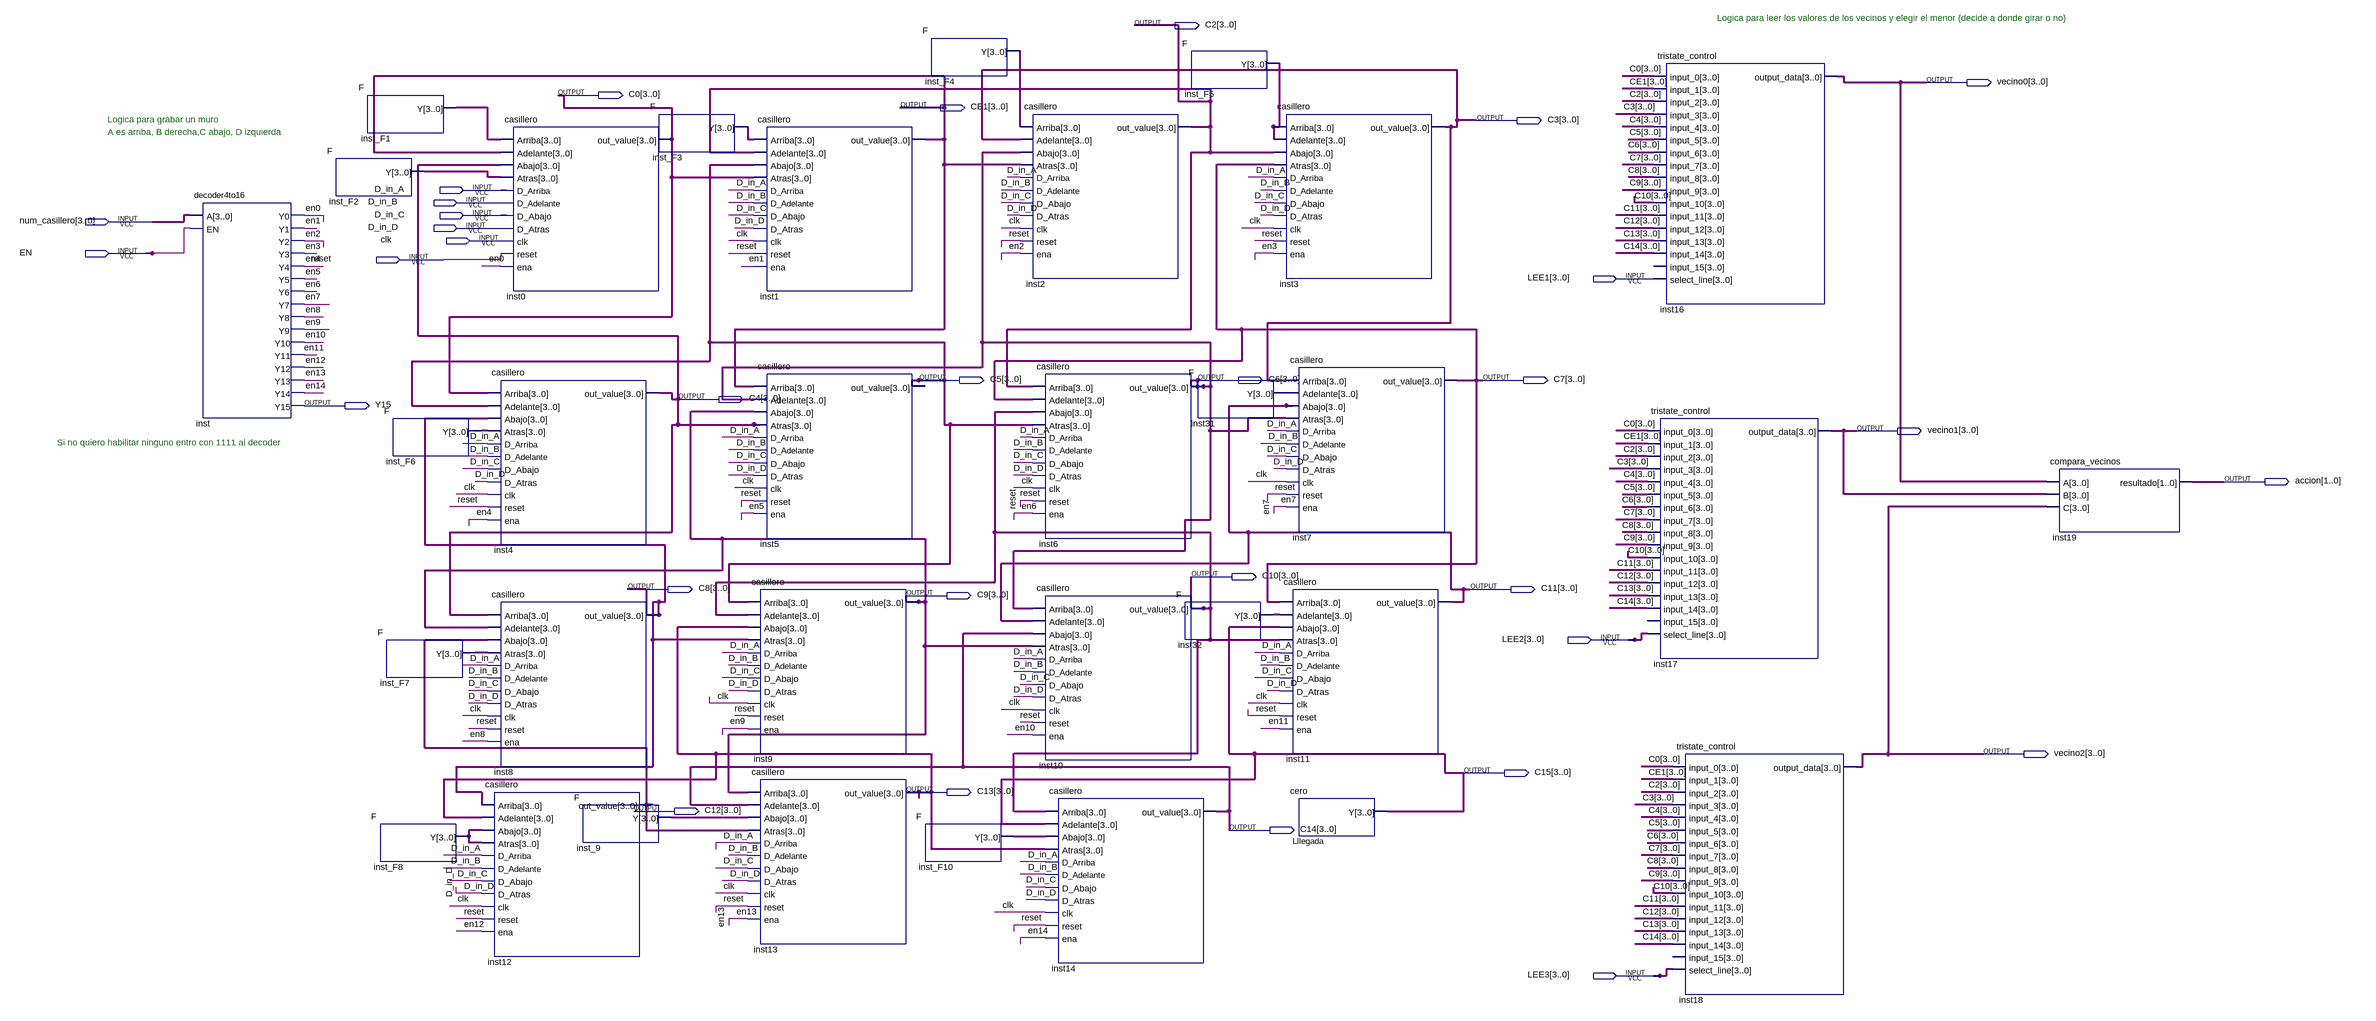
[diagram p0: schematic sheet]
// Quartus schematic matriz_pru.bdf as structural Verilog: 33 symbols, 32 pins
module matriz_pru (
  input  D_in_A,
  input  D_in_B,
  input  D_in_C,
  input  [3:0] num_casillero,
  input  D_in_D,
  input  clk,
  input  EN,
  input  reset,
  input  [3:0] LEE1,
  input  [3:0] LEE2,
  input  [3:0] LEE3,
  output [3:0] C2,
  output [3:0] vecino0,
  output [3:0] C0,
  output [3:0] CE1,
  output [3:0] C3,
  output [3:0] C5,
  output [3:0] C6,
  output [3:0] C7,
  output [3:0] C4,
  output Y15,
  output [3:0] vecino1,
  output [1:0] accion,
  output [3:0] C10,
  output [3:0] C8,
  output [3:0] C11,
  output [3:0] C9,
  output [3:0] vecino2,
  output [3:0] C15,
  output [3:0] C13,
  output [3:0] C12,
  output [3:0] C14
);

  wire en0, en1, en2, en3, en4, en5, en6, en7, en8, en9, en10, en11, en12, en13, en14;
  wire [3:0] inst12_out_value, inst31_y, inst32_y, inst_9_y, inst_F1_y, inst_F2_y, inst_F3_y, inst_F4_y,
       inst_F5_y, inst_F6_y, inst_F7_y, inst_F8_y, inst_F10_y;

  decoder4to16 inst (
    .A(num_casillero), .EN(EN), .Y0(en0), .Y1(en1), .Y2(en2), .Y3(en3), .Y4(en4), .Y5(en5), .Y6(en6),
    .Y7(en7), .Y8(en8), .Y9(en9), .Y10(en10), .Y11(en11), .Y12(en12), .Y13(en13), .Y14(en14), .Y15(Y15));
  F inst_F2 (.Y(inst_F2_y));
  F inst_F1 (.Y(inst_F1_y));
  F inst_F6 (.Y(inst_F6_y));
  F inst_F7 (.Y(inst_F7_y));
  F inst_F8 (.Y(inst_F8_y));
  casillero inst12 (
    .Arriba(C8), .Adelante(C13), .Abajo(inst_F8_y), .Atras(inst_F8_y), .D_Arriba(D_in_A),
    .D_Adelante(D_in_B), .D_Abajo(D_in_C), .D_Atras(D_in_D), .clk(clk), .reset(reset), .ena(en12),
    .out_value(inst12_out_value));
  casillero inst0 (
    .Arriba(inst_F1_y), .Adelante(CE1), .Abajo(C4), .Atras(inst_F2_y), .D_Arriba(D_in_A),
    .D_Adelante(D_in_B), .D_Abajo(D_in_C), .D_Atras(D_in_D), .reset(reset), .ena(en0), .out_value(C0));  // open: clk
  casillero inst4 (
    .Arriba(C0), .Adelante(C5), .Abajo(C8), .Atras(inst_F6_y), .D_Arriba(D_in_A), .D_Adelante(D_in_B),
    .D_Abajo(D_in_C), .D_Atras(D_in_D), .clk(clk), .reset(reset), .ena(en4), .out_value(C4));
  casillero inst8 (
    .Arriba(C4), .Adelante(C9), .Abajo(inst12_out_value), .Atras(inst_F7_y), .D_Arriba(D_in_A),
    .D_Adelante(D_in_B), .D_Abajo(D_in_C), .D_Atras(D_in_D), .clk(clk), .reset(reset), .ena(en8),
    .out_value(C8));
  F inst_9 (.Y(inst_9_y));
  F inst_F3 (.Y(inst_F3_y));
  casillero inst1 (
    .Arriba(inst_F3_y), .Adelante(C2), .Abajo(C5), .Atras(C0), .D_Arriba(D_in_A), .D_Adelante(D_in_B),
    .D_Abajo(D_in_C), .D_Atras(D_in_D), .clk(clk), .reset(reset), .ena(en1), .out_value(CE1));
  casillero inst5 (
    .Arriba(CE1), .Adelante(C6), .Abajo(C9), .Atras(C4), .D_Arriba(D_in_A), .D_Adelante(D_in_B),
    .D_Abajo(D_in_C), .D_Atras(D_in_D), .clk(clk), .reset(reset), .ena(en5), .out_value(C5));
  casillero inst9 (
    .Arriba(C5), .Adelante(C10), .Abajo(C13), .Atras(C8), .D_Arriba(D_in_A), .D_Adelante(D_in_B),
    .D_Abajo(D_in_C), .D_Atras(D_in_D), .clk(clk), .reset(reset), .ena(en9), .out_value(C9));
  casillero inst13 (
    .Arriba(C9), .Adelante(C14), .Abajo(inst_9_y), .Atras(inst12_out_value), .D_Arriba(D_in_A),
    .D_Adelante(D_in_B), .D_Abajo(D_in_C), .D_Atras(D_in_D), .clk(clk), .reset(reset), .ena(en13),
    .out_value(C13));
  F inst_F4 (.Y(inst_F4_y));
  F inst_F10 (.Y(inst_F10_y));
  casillero inst2 (
    .Arriba(inst_F4_y), .Adelante(C3), .Abajo(C6), .Atras(CE1), .D_Arriba(D_in_A), .D_Adelante(D_in_B),
    .D_Abajo(D_in_C), .D_Atras(D_in_D), .clk(clk), .reset(reset), .ena(en2), .out_value(C2));
  casillero inst6 (
    .Arriba(C2), .Adelante(C7), .Abajo(C10), .Atras(C5), .D_Arriba(D_in_A), .D_Adelante(D_in_B),
    .D_Abajo(D_in_C), .D_Atras(D_in_D), .clk(clk), .reset(reset), .ena(en6), .out_value(C6));
  casillero inst10 (
    .Arriba(C6), .Adelante(C11), .Abajo(C14), .Atras(C9), .D_Arriba(D_in_A), .D_Adelante(D_in_B),
    .D_Abajo(D_in_C), .D_Atras(D_in_D), .clk(clk), .reset(reset), .ena(en10), .out_value(C10));
  casillero inst14 (
    .Arriba(C10), .Adelante(C15), .Abajo(inst_F10_y), .Atras(C13), .D_Arriba(D_in_A), .D_Adelante(D_in_B),
    .D_Abajo(D_in_C), .D_Atras(D_in_D), .clk(clk), .reset(reset), .ena(en14), .out_value(C14));
  F inst_F5 (.Y(inst_F5_y));
  F inst31 (.Y(inst31_y));
  F inst32 (.Y(inst32_y));
  casillero inst3 (
    .Arriba(inst_F5_y), .Adelante(inst_F5_y), .Abajo(C2), .Atras(C7), .D_Arriba(D_in_A), .D_Adelante(D_in_B),
    .D_Abajo(D_in_C), .D_Atras(D_in_D), .clk(clk), .reset(reset), .ena(en3), .out_value(C3));
  casillero inst7 (
    .Arriba(C3), .Adelante(inst31_y), .Abajo(C11), .Atras(C6), .D_Arriba(D_in_A), .D_Adelante(D_in_B),
    .D_Abajo(D_in_C), .D_Atras(D_in_D), .clk(clk), .reset(reset), .ena(en7), .out_value(C7));
  casillero inst11 (
    .Arriba(C7), .Adelante(inst32_y), .Abajo(C15), .Atras(C10), .D_Arriba(D_in_A), .D_Adelante(D_in_B),
    .D_Abajo(D_in_C), .D_Atras(D_in_D), .clk(clk), .reset(reset), .ena(en11), .out_value(C11));
  cero Lllegada (.Y(C15));
  tristate_control inst17 (
    .input_0(C0), .input_1(CE1), .input_2(C2), .input_3(C3), .input_4(C4), .input_5(C5), .input_6(C6),
    .input_7(C7), .input_8(C8), .input_9(C9), .input_10(C10), .input_11(C11), .input_12(C12), .input_13(C13),
    .input_14(C14), .select_line(LEE2), .output_data(vecino1));  // open: input_15
  tristate_control inst16 (
    .input_0(C0), .input_1(CE1), .input_2(C2), .input_3(C3), .input_4(C4), .input_5(C5), .input_6(C6),
    .input_7(C7), .input_8(C8), .input_9(C9), .input_10(C10), .input_11(C11), .input_12(C12), .input_13(C13),
    .input_14(C14), .output_data(vecino0));  // open: input_15, select_line
  tristate_control inst18 (
    .input_0(C0), .input_1(CE1), .input_2(C2), .input_3(C3), .input_4(C4), .input_5(C5), .input_6(C6),
    .input_7(C7), .input_8(C8), .input_9(C9), .input_10(C10), .input_11(C11), .input_12(C12), .input_13(C13),
    .input_14(C14), .select_line(LEE3), .output_data(vecino2));  // open: input_15
  compara_vecinos inst19 (.A(vecino0), .B(vecino1), .C(vecino2), .resultado(accion));

  // Notes on the sheet:
  //   Logica para leer los valores de los vecinos y elegir el menor (decide a donde girar o no)
  //   Logica para grabar un muro
  //   A es arriba, B derecha,C abajo, D izquierda
  //   Si no quiero habilitar ninguno entro con 1111 al decoder
endmodule
